# Altium schematic sheet ST_LINK_V2-1.SCHDOC: ST-LINK/V2-1 with support of SWD only
size A4; Project: STM32MP15-DISCO PI; Date: Not used; ApprovedBy: Not used; CheckedBy: Not used; Author: Not used; CompanyName: STMicroelectronics; DrawnBy: Not used; Engineer: Not used; Organization: Not used; Address1: Not used; Address2: Not used; Address3: Not used; Address4: Not used; DocumentNumber: 15; Revision: Not used; SheetNumber: 15; SheetTotal: 15; CurrentTime: Not used; CurrentDate: Not used; Time: Not used; DocumentFullPathAndName: Not used; DocumentName: Not used; ModifiedDate: Not used; ImagePath: Not used; ProjectName: Not used; Application_BuildNumber: Not used
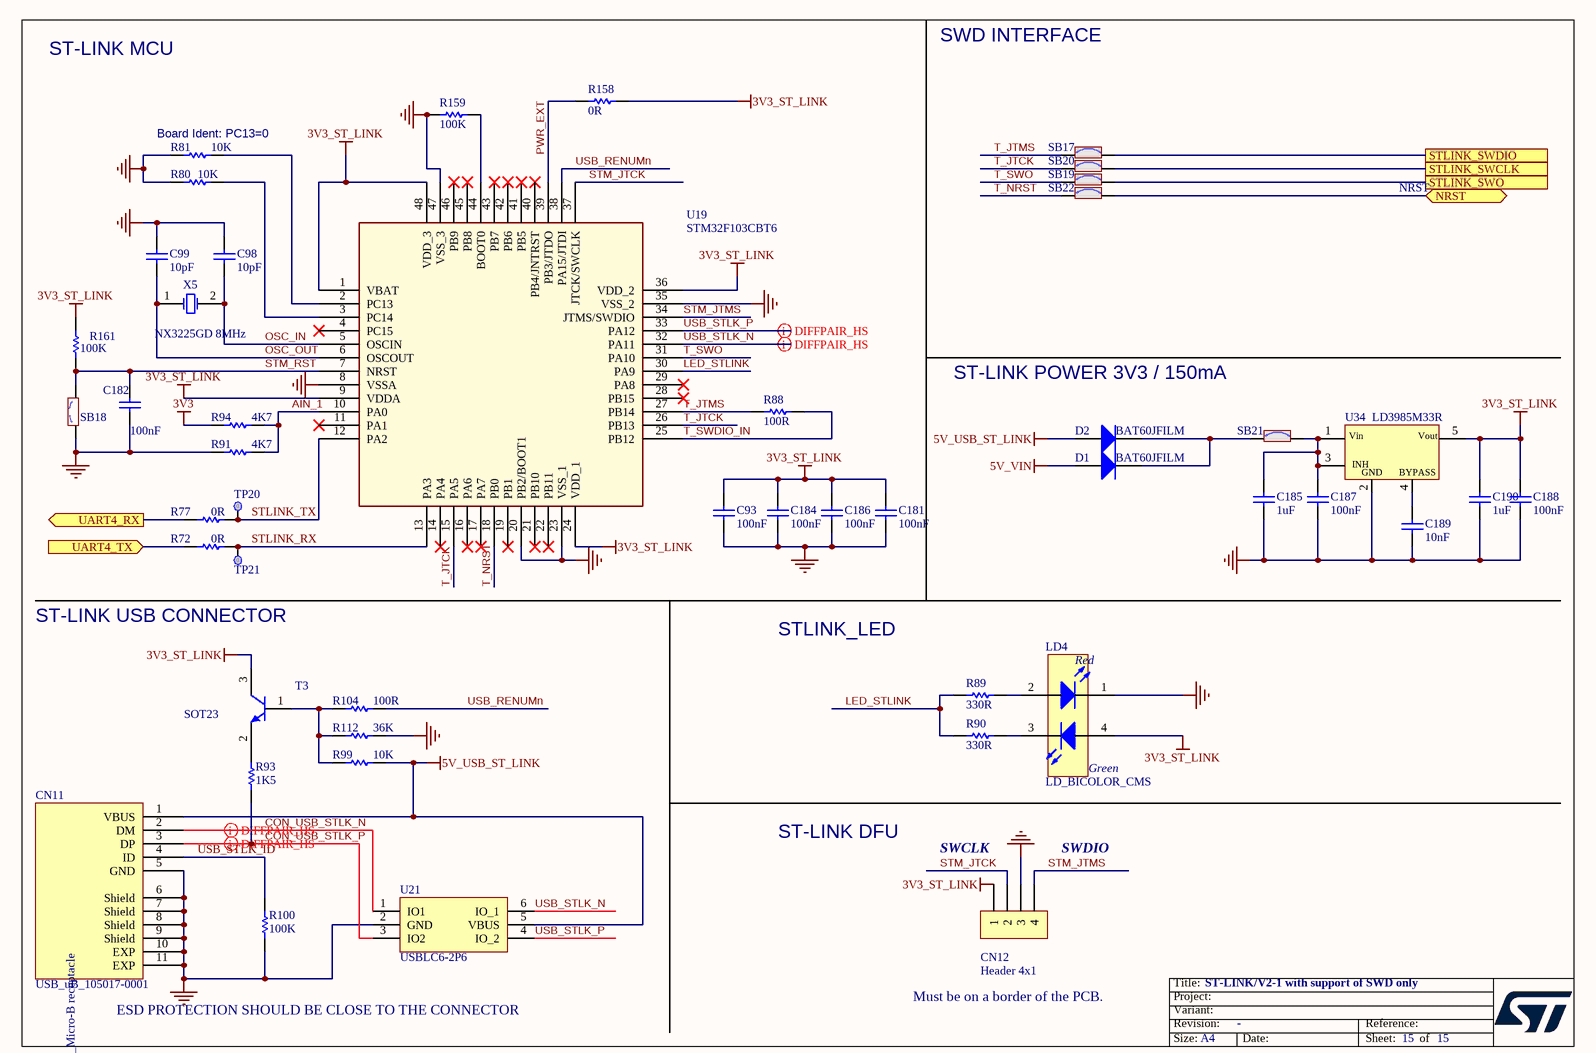
[diagram p0: ST_LINK_V2-1.SCHDOC]

## Parts
C93  value 100nF  [C0402]
C98  value 10pF  [C0402]
C99  value 10pF  [C0402]
C181  value 100nF  [C0402]
C182  value 100nF  [C0402]
C184  value 100nF  [C0402]
C185  value 1uF  [C0603]
C186  value 100nF  [C0402]
C187  value 100nF  [C0402]
C188  value 100nF  [C0402]
C189  value 10nF  [C0402]
C190  value 1uF  [C0603]
CN11  value USB_uB_105017-0001  [CON_USBMICROB_MOLEX_105017-0001_H2P90]
CN12  value Header 4x1  [CON_SAMTEC_TSW-104-07-G-S]
D1  value BAT60JFILM  [DIO_SOD323]
D2  value BAT60JFILM  [DIO_SOD323]
LD4  LD_BICOLOR_CMS  [LED_BI-GR_HSMF-A201-A00J1]
R72  value 0R  [R0402]
R77  value 0R  [R0402]
R80  value 10K  [R0402]
R81  value 10K  [R0402]
R88  value 100R  [R0402]
R89  value 330R  [R0402]
R90  value 330R  [R0402]
R91  value 4K7  [R0402]
R93  value 1K5  [R0402]
R94  value 4K7  [R0402]
R99  value 10K  [R0402]
R100  value 100K  [R0402]
R104  value 100R  [R0402]
R112  value 36K  [R0402]
R158  value 0R  [R0402]
R159  value 100K  [R0402]
R161  value 100K  [R0402]
SB17  (no value)  [SOLDER-BRIDGE_R0603-0R]
SB18  (no value)  [SOLDER-BRIDGE_R0603-0R]
SB19  (no value)  [SOLDER-BRIDGE_R0603-0R]
SB20  (no value)  [SOLDER-BRIDGE_R0603-0R]
SB21  (no value)  [SOLDER-BRIDGE_R0603-0R]
SB22  (no value)  [SOLDER-BRIDGE_R0603-0R]
T3  value SOT23  [NPN_SOT23]
TP20  Test Point  [TP_SMD_1MM]  (value not drawn)  (no BOM)
TP21  Test Point  [TP_SMD_1MM]  (value not drawn)  (no BOM)
U19  value STM32F103CBT6  [ICC_LQFP48_7X7_P050]
U21  value USBLC6-2P6  [ESD_SOT666]
U34  value LD3985M33R  [REG_SOT23-5L]
X5  value NX3225GD 8MHz  [CRY_NX3225GD_2P]

## Ports
NRST (bidir), STLINK_SWCLK, STLINK_SWDIO, STLINK_SWO, UART4_RX (out), UART4_TX (in)

## Nets
3V3: R94.1
3V3_ST_LINK: C93.2 C181.2 C184.2 C186.2 C188.2 C190.2 CN12.1 LD4.4(YellowGreen_anode) R158.2 R161.2 T3.3(C) U19.1(VBAT) U19.9(VDDA) U19.24(VDD_1) U19.36(VDD_2) U19.48(VDD_3) U34.5(Vout)
5V_USB_ST_LINK: CN11.1(VBUS) D2.1(A) R99.1 U21.5(VBUS)
5V_VIN: D1.1(A)
GND: C93.1 C98.2 C99.2 C181.1 C182.1 C184.1 C185.2 C186.1 C187.1 C188.1 C189.1 C190.1 CN11.5(GND) CN11.6(Shield) CN11.7(Shield) CN11.8(Shield) CN11.9(Shield) CN11.10(EXP) CN11.11(EXP) CN12.3 LD4.1(RED_cathode) R80.1 R81.2 R91.1 R100.1 R112.1 R159.1 SB18.1 U19.8(VSSA) U19.20(PB2/BOOT1) U19.23(VSS_1) U19.35(VSS_2) U19.47(VSS_3) U21.2(GND) U34.2(GND)
AIN_1: R91.2 R94.2 U19.10(PA0)
CON_USB_STLK_N: CN11.2(DM) U21.1(IO1)
CON_USB_STLK_P: CN11.3(DP) R93.1 U21.3(IO2)
LED_STLINK: R89.2 R90.2 U19.30(PA9)
NRST: SB22.2 ; port NRST
OSC_IN: C98.1 U19.5(OSCIN) X5.2(OSC2)
OSC_OUT: C99.1 U19.6(OSCOUT) X5.1(OSC1)
PWR_EXT: R158.1 U19.39(PB3/JTDO)
STLINK_RX: R72.2 TP21.1 U19.13(PA3)
STLINK_SWCLK: SB20.2 ; port STLINK_SWCLK
STLINK_SWDIO: SB17.2 ; port STLINK_SWDIO
STLINK_SWO: SB19.2 ; port STLINK_SWO
STLINK_TX: R77.1 TP20.1 U19.12(PA2)
STM_JTCK: CN12.2 U19.37(JTCK/SWCLK)
STM_JTMS: CN12.4 U19.34(JTMS/SWDIO)
STM_RST: C182.2 R161.1 SB18.2 U19.7(NRST)
T_JTCK: SB20.1 U19.15(PA5) U19.26(PB13)
T_JTMS: R88.1 SB17.1 U19.27(PB14)
T_NRST: SB22.1 U19.18(PB0)
T_SWDIO_IN: R88.2 U19.25(PB12)
T_SWO: SB19.1 U19.31(PA10)
UART4_RX: R77.2 ; port UART4_RX
UART4_TX: R72.1 ; port UART4_TX
USB_RENUMn: R104.2 U19.38(PA15/JTDI)
USB_STLK_ID: CN11.4(ID) R100.2
USB_STLK_N: U19.32(PA11) U21.6(IO_1)
USB_STLK_P: U19.33(PA12) U21.4(IO_2)
NetC185_1: C185.1 C187.2 SB21.2 U34.1(Vin) U34.3(CE)
NetC189_2: C189.2 U34.4(BYPASS)
NetD1_2: D1.2(K) D2.2(K) SB21.1
NetLD4_2: LD4.2(Red_anode) R89.1
NetLD4_3: LD4.3(YellowGreen_cathode) R90.1
NetR80_2: R80.2 U19.3(PC14)
NetR81_1: R81.1 U19.2(PC13)
NetR93_2: R93.2 T3.2(E)
NetR99_2: R99.2 R104.1 R112.2 T3.1(B)
NetR159_2: R159.2 U19.44(BOOT0)

Not connected (* = marked no-connect by the designer): U19 4(PC15)* 11(PA1)* 14(PA4)* 16(PA6)* 17(PA7)* 19(PB1)* 21(PB10)* 22(PB11)* 28(PB15)* 29(PA8)* 40(PB4/JNTRST)* 41(PB5)* 42(PB6)* 43(PB7)* 45(PB8)* 46(PB9)*

## Layout directives
differential pair: CON_USB_STLK_N, CON_USB_STLK_P, USB_STLK_N, USB_STLK_P

## Notes on the sheet
- ST-LINK MCU
- SWD INTERFACE
- (near R81) Board Ident: PC13=0
- NRST
- ST-LINK POWER 3V3 / 150mA
- ST-LINK USB CONNECTOR
- STLINK_LED
- ST-LINK DFU
- SWCLK
- SWDIO
- Must be on a border of the PCB.
- (near CN11) ESD PROTECTION SHOULD BE CLOSE TO THE CONNECTOR
- Title:
- Project:
- Size:
- Revision:
- Variant:
- A4
- -
- Date:
- Reference:
- Sheet:
- of
- (in symbol MCD-00028) USB_Micro-B receptacle
- (in symbol MCD-00086) INH
- (in symbol MCD-02402) Red; Green

## Library data of the parts
C93 C181 C182 C184 C186-C188 = MCD-00006: Capacitor,100nF,16V,X7R,10%,0402; Manufacturer_Part_Number: CC0402KRX7R7BB104; Manufacturer: YAGEO; Alternate_Manufacturer: MURATA; Alternate_Manufacturer_Part_Number: GCM155R71C104KA55D; Provided_By: SUBCO; Initial_Board_Reference: mb1274; Internal_Part_Number: MCD-00006; ComponentLink1Description: Datasheet; ECCN_US: n/a; ECCN_EU: n/a; Status: Released; Part_Type: Capacitor; Package: C0402; ComponentLink1URL: http://tunmcdsvn.tun.st.com/Component_Datasheet_Library/Trunk/Capacitors/Yageo_Multilayer_Capacitor_X7R_series_100pF_to_22uF
C98 C99 = MCD-00015: Capacitor,10pF,50V,NPO,5%,0402; Manufacturer_Part_Number: CC0402JRNPO9BN100; Manufacturer: YAGEO; Provided_By: SUBCO; Initial_Board_Reference: mb1274; Internal_Part_Number: MCD-00015; ComponentLink1Description: Datasheet; ECCN_US: n/a; ECCN_EU: n/a; Status: Released; Part_Type: Capacitor; Package: C0402; ComponentLink1URL: http://tunmcdsvn.tun.st.com/Component_Datasheet_Library/Trunk/Capacitors/Yageo_Capacitor_NP0_16V-to-50V
C185 C190 = MCD-00238: Capacitor,1uF,6V3,X5R,10%,0603; Manufacturer_Part_Number: CC0603KRX5R5BB105; Manufacturer: YAGEO; Provided_By: SUBCO; Initial_Board_Reference: mb1319; Internal_Part_Number: MCD-00238; ComponentLink1Description: Datasheet; ECCN_US: n/a; ECCN_EU: n/a; Status: Released; Part_Type: Capacitor; Package: C0603; ComponentLink1URL: http://tunmcdsvn.tun.st.com/Component_Datasheet_Library/Trunk/Capacitors/Yageo_Multilayer_capacitor_X5R_series_100pF_to_100uF
C189 = MCD-00011: Capacitor,10nF,16V,X7R,10%,0402; Manufacturer_Part_Number: CC0402KRX7R7BB103; Manufacturer: YAGEO; Provided_By: SUBCO; Initial_Board_Reference: mb1274; Internal_Part_Number: MCD-00011; ComponentLink1Description: Datasheet; ECCN_US: n/a; ECCN_EU: n/a; Status: Released; Part_Type: Capacitor; Package: C0402; ComponentLink1URL: http://tunmcdsvn.tun.st.com/Component_Datasheet_Library/Trunk/Capacitors/Yageo_Multilayer_Capacitor_X7R_series_100pF_to_22uF
CN11 = MCD-00028: USB-MICRO-B, 0.65mm, RA, SMT, Bottom Mount,; Manufacturer_Part_Number: 1050170001; Manufacturer: MOLEX; Part_Type: Connector; Provided_By: SUBCO; Initial_Board_Reference: mb1274; Internal_Part_Number: MCD-00028; ComponentLink1Description: Datasheet; ECCN_US: n/a; ECCN_EU: n/a; Status: Released; ComponentLink1URL: http://tunmcdsvn.tun.st.com/Component_Datasheet_Library/Trunk/Connectors/Molex_Connector-USB-microB_105017-0001
CN12 = MCD-00029: Header, 4x1, 2,54mm, VR, TH, Height 5.84mm/2.54mm; Manufacturer_Part_Number: TSW-104-07-x-S; Manufacturer: SAMTEC; Part_Type: Connector; Provided_By: SUBCO; Initial_Board_Reference: mb1274; Internal_Part_Number: MCD-00029; ComponentLink1Description: Datasheet; ECCN_US: n/a; ECCN_EU: n/a; Status: Released; ComponentLink1URL: http://tunmcdsvn.tun.st.com/Component_Datasheet_Library/Trunk/Connectors/Samtec_TSW-HTSW-series
D1 D2 = MCD-00034: BAT60JFILM; Manufacturer: STMICROELECTRONICS; Part_Type: Diode; BMS_Part_Number: 9151097; ECCN_US: EAR99; ECCN_EU: NEC; Provided_By: SUBCO with ST control; Initial_Board_Reference: mb1274; Internal_Part_Number: MCD-00034; Manufacturer_Part_Number: BAT60JFILM; ComponentLink1Description: Datasheet; Status: Released; ComponentLink1URL: http://tunmcdsvn.tun.st.com/Component_Datasheet_Library/Trunk/Diodes/STM_Diode_BAT60JFILM-SOD323
LD4 = MCD-02402: LED Bicolor; Part_Type: Display; Part_Preference: Alternate; Manufacturer: EVERLIGHT; Manufacturer_Part_Number: 67-22sursygc-s530-a2-tr8; Full_Alternate_Internal_Part_Number: MCD-00051, MCD-02631; Alternate_EMS: C; ShowFields: YES; ID: 4508; Internal_Part_Number: MCD-02402; Value: LD_BICOLOR_CMS; Status: Released; ComponentLink1URL: http://tunmcdsvn.tun.st.com/Component_Documentation_Library/Trunk/Display/EVERLIGHT_67-22sursygc-s530-a2-tr8; Order_Code_Digikey: N/A; Order_Code_Farnell: N/A; Order_Code_RS: N/A
R72 R77 R158 = MCD-00052: Resistor,0R,0402,5%,1/16W; Manufacturer_Part_Number: RC0402JR-070RL; Manufacturer: YAGEO; Provided_By: SUBCO; Initial_Board_Reference: mb1274; Internal_Part_Number: MCD-00052; ComponentLink1Description: Datasheet; ECCN_US: n/a; ECCN_EU: n/a; Status: Released; Part_Type: Resistor; ComponentLink1URL: http://tunmcdsvn.tun.st.com/Component_Datasheet_Library/Trunk/Resistors/Yageo_Resistor_RC0402-series; Package: R0402
R80 R81 R99 = MCD-00053: Resistor,10K,0402,1%,1/16W; Manufacturer_Part_Number: RC0402FR-0710KL; Manufacturer: YAGEO; Provided_By: SUBCO; Initial_Board_Reference: mb1274; Internal_Part_Number: MCD-00053; ComponentLink1Description: Datasheet; ECCN_US: n/a; ECCN_EU: n/a; Status: Released; Part_Type: Resistor; ComponentLink1URL: http://tunmcdsvn.tun.st.com/Component_Datasheet_Library/Trunk/Resistors/Yageo_Resistor_RC0402-series; Package: R0402
R88 R104 = MCD-00067: Resistor,100R,0402,1%,1/16W; Manufacturer_Part_Number: RC0402FR-07100RL; Manufacturer: YAGEO; Provided_By: SUBCO; Initial_Board_Reference: mb1274; Internal_Part_Number: MCD-00067; ComponentLink1Description: Datasheet; ECCN_US: n/a; ECCN_EU: n/a; Status: Released; Part_Type: Resistor; ComponentLink1URL: http://tunmcdsvn.tun.st.com/Component_Datasheet_Library/Trunk/Resistors/Yageo_Resistor_RC0402-series; Package: R0402
R89 R90 = MCD-00062: Resistor,330R,0402,1%,1/16W; Manufacturer_Part_Number: RC0402FR-07330RL; Manufacturer: YAGEO; Provided_By: SUBCO; Initial_Board_Reference: mb1274; Internal_Part_Number: MCD-00062; ComponentLink1Description: Datasheet; ECCN_US: n/a; ECCN_EU: n/a; Status: Released; Part_Type: Resistor; ComponentLink1URL: http://tunmcdsvn.tun.st.com/Component_Datasheet_Library/Trunk/Resistors/Yageo_Resistor_RC0402-series; Package: R0402
R91 R94 = MCD-00065: Resistor,4K7,0402,1%,1/16W; Manufacturer_Part_Number: RC0402FR-074K7L; Manufacturer: YAGEO; Alternate_Manufacturer_Part_Number: RT0402FRE074K7L; Provided_By: SUBCO; Initial_Board_Reference: mb1274; Internal_Part_Number: MCD-00065; Alternate_Manufacturer: YAGEO; ComponentLink1Description: Datasheet; ECCN_US: n/a; ECCN_EU: n/a; Status: Released; Part_Type: Resistor; ComponentLink1URL: http://tunmcdsvn.tun.st.com/Component_Datasheet_Library/Trunk/Resistors/Yageo_Resistor_RC0402-series; Package: R0402
R93 = MCD-00068: Resistor,1K5,0402,1%,1/16W; Manufacturer_Part_Number: RC0402FR-071K5L; Manufacturer: YAGEO; Provided_By: SUBCO; Initial_Board_Reference: mb1274; Internal_Part_Number: MCD-00068; ComponentLink1Description: Datasheet; ECCN_US: n/a; ECCN_EU: n/a; Status: Released; Part_Type: Resistor; ComponentLink1URL: http://tunmcdsvn.tun.st.com/Component_Datasheet_Library/Trunk/Resistors/Yageo_Resistor_RC0402-series; Package: R0402
R100 R159 R161 = MCD-00059: Resistor,100K,0402,1%,1/16W; Manufacturer_Part_Number: RC0402FR-07100KL; Manufacturer: YAGEO; Alternate_Manufacturer_Part_Number: RT0402FRE07100KL; Provided_By: SUBCO; Initial_Board_Reference: mb1274; Internal_Part_Number: MCD-00059; Alternate_Manufacturer: YAGEO; ComponentLink1Description: Datasheet; ECCN_US: n/a; ECCN_EU: n/a; Status: Released; Part_Type: Resistor; ComponentLink1URL: http://tunmcdsvn.tun.st.com/Component_Datasheet_Library/Trunk/Resistors/Yageo_Resistor_RC0402-series; Package: R0402
R112 = MCD-00069: Resistor,36K,0402,1%,1/16W; Manufacturer_Part_Number: RC0402FR-0736KL; Manufacturer: YAGEO; Provided_By: SUBCO; Initial_Board_Reference: mb1274; Internal_Part_Number: MCD-00069; ComponentLink1Description: Datasheet; ECCN_US: n/a; ECCN_EU: n/a; Status: Released; Part_Type: Resistor; ComponentLink1URL: http://tunmcdsvn.tun.st.com/Component_Datasheet_Library/Trunk/Resistors/Yageo_Resistor_RC0402-series; Package: R0402
SB17 SB19-SB22 = MCD-00071: Solder Bridge ON; Part_Type: Mechanical; Manufacturer: YAGEO; Manufacturer_Part_Number: RC0603JR-070RL; Provided_By: SUBCO; Initial_Board_Reference: mb1274; Internal_Part_Number: MCD-00071; ECCN_US: n/a; ECCN_EU: n/a; Status: Released; ComponentLink1Description: Datasheet; ComponentLink1URL: http://tunmcdsvn.tun.st.com/Component_Datasheet_Library/Trunk/Resistors/Yageo_Resistor_RC0603-series; Package: SB0603
SB18 = MCD-00072: Solder Bridge OFF; Part_Type: Mechanical; Manufacturer: YAGEO; Manufacturer_Part_Number: RC0603JR-070RL; Provided_By: SUBCO; Initial_Board_Reference: mb1274; Internal_Part_Number: MCD-00072; ECCN_US: n/a; ECCN_EU: n/a; Status: Released; ComponentLink1Description: Datasheet; ComponentLink1URL: http://tunmcdsvn.tun.st.com/Component_Datasheet_Library/Trunk/Resistors/Yageo_Resistor_RC0603-series; Package: SB0603
T3 = MCD-00073: NPN Bipolar Transistor; Manufacturer_Part_Number: BSR14; Manufacturer: ON SEMICONDUCTOR; Part_Type: IC; Alternate_Manufacturer_Part_Number: MMBT2222ALT1G / MMBT2222ALT3G; ECCN_US: EAR99; ECCN_EU: NEC; Provided_By: SUBCO; Initial_Board_Reference: mb1274; Revision: *; Internal_Part_Number: MCD-00073; ComponentLink1Description: Datasheet; Status: Released; ComponentLink1URL: http://tunmcdsvn.tun.st.com/Component_Datasheet_Library/Trunk/IC/NXP_Transistor_BSR14; Alternate_Manufacturer: ON SEMICONDUCTOR
TP20 TP21 = MCD-00074: Test Point 1mm; Part_Type: Mechanical; Initial_Board_Reference: MB1274; Internal_Part_Number: MCD-00074; Status: Released; Manufacturer_Part_Number: n/a; Manufacturer: n/a; ComponentLink1Description: Datasheet; ComponentLink1URL: http://na; ECCN_US: n/a; ECCN_EU: n/a; Provided_By: n/a
U19 = MCD-00085: Medium-density performance line ARM-based 32-bit MCU with 128KB Flash; Manufacturer: STMICROELECTRONICS; Part_Type: IC; BMS_Part_Number: 9175111; ECCN_US: 3A991A2; ECCN_EU: NEC; Provided_By: SUBCO with ST control; Initial_Board_Reference: mb1274; Internal_Part_Number: MCD-00085; Manufacturer_Part_Number: STM32F103CBT6; ComponentLink1Description: Datasheet; Status: Released; ComponentLink1URL: http://tunmcdsvn.tun.st.com/Component_Datasheet_Library/Trunk/IC/STM_STM32F103CBT6
U21 = MCD-00169: USB OTG FS ESD protection; Manufacturer: STMICROELECTRONICS; Part_Type: IC; BMS_Part_Number: 9151057; Provided_By: SUBCO with ST control; ECCN_US: EAR99; ECCN_EU: NEC; Initial_Board_Reference: MB1274; Internal_Part_Number: MCD-00169; Manufacturer_Part_Number: USBLC6-2P6; ComponentLink1Description: Datasheet; Status: Released; ComponentLink1URL: http://tunmcdsvn.tun.st.com/Component_Datasheet_Library/Trunk/Diodes/STM_ESD_USBLC6-2
U34 = MCD-00086: Ultra low drop-low noise BiCMOS voltage, regulators low ESR capacitors compatible; Manufacturer: STMICROELECTRONICS; Part_Type: IC; BMS_Part_Number: 9176161; ECCN_US: EAR99; ECCN_EU: NEC; Provided_By: SUBCO with ST control; Initial_Board_Reference: mb1274; Internal_Part_Number: MCD-00086; Manufacturer_Part_Number: LD3985M33R; ComponentLink1Description: Datasheet; Status: Released; ComponentLink1URL: http://tunmcdsvn.tun.st.com/Component_Datasheet_Library/Trunk/IC/STM_LDO_LD3985
X5 = MCD-00092: Crystal 8Mhz, 8pF, -+50PPM, SMD; Manufacturer_Part_Number: NX3225GD 8MHz EXS00A-CG04874; Manufacturer: NDK; Part_Type: Crystal_Osc; BMS_Part_Number: 9157029; ECCN_US: EAR99; ECCN_EU: NEC; Provided_By: SUBCO; Initial_Board_Reference: mb1274; Internal_Part_Number: MCD-00092; ComponentLink1Description: Datasheet; Status: Released; ComponentLink1URL: http://tunmcdsvn.tun.st.com/Component_Datasheet_Library/Trunk/Crystal_Osc/NDK_Crystal-For-ST_NX3225GD 8MHz EXS00A-CG04874 (EXS10B-20725)